# Altium schematic sheet 01-POWER.SchDoc
size A4
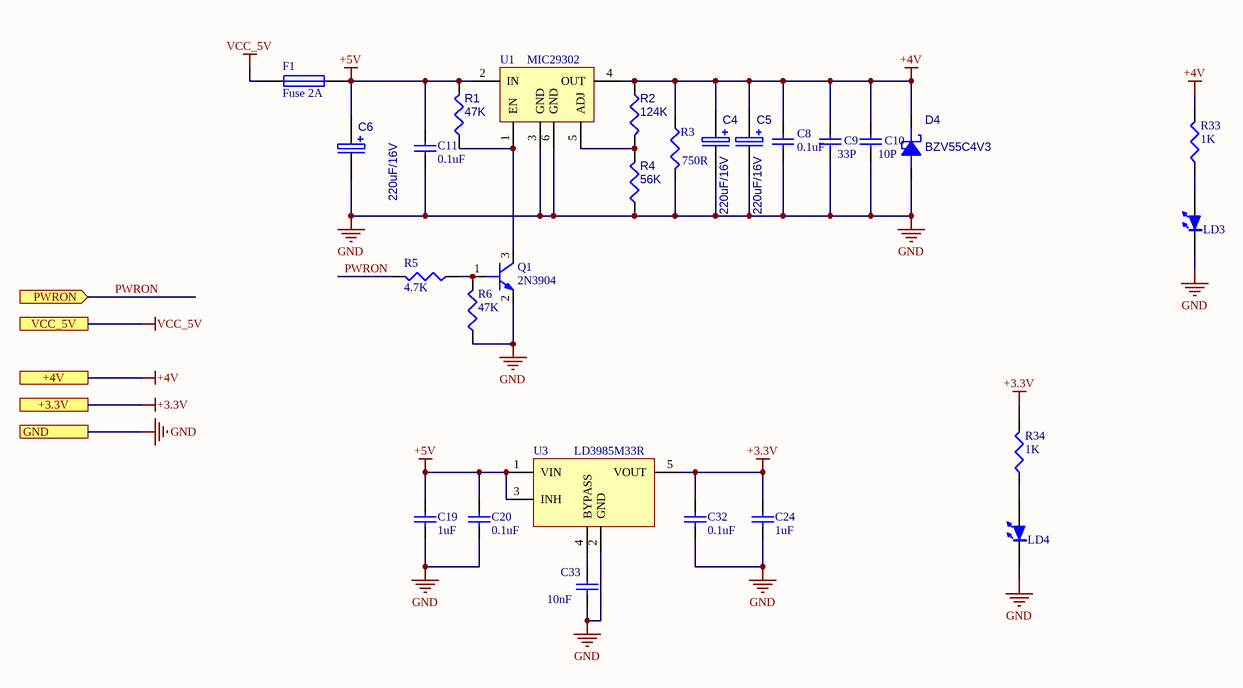
[diagram p0: 01-POWER.SchDoc]

## Parts
C4  220uF/16V  [C_TAN_D]
C5  220uF/16V  [C_TAN_D]
C6  220uF/16V  [C_TAN_D]
C8  0.1uF  [0603_C]
C9  33P  [0603_C]
C10  10P  [0603_C]
C11  0.1uF  [0603_C]
C19  1uF  [0603_C]
C20  0.1uF  [0603_C]
C24  1uF  [0603_C]
C32  0.1uF  [0603_C]
C33  10nF  [0603_C]
D4  BZV55C4V3  [SOD-80]
F1  Fuse 2A  [1812_F]
LD3  WHITE  [LED_0603]  (value not drawn)
LD4  WHITE  [LED_0603]  (value not drawn)
Q1  2N3904  [SOT23]
R1  47K  [0603_R]
R2  124K  [0603_R]
R3  750R  [0603_R]
R4  56K  [0603_R]
R5  4.7K  [0603_R]
R6  47K  [0603_R]
R33  1K  [0603_R]
R34  1K  [0603_R]
U1  MIC29302  [TO-263-5]
U3  LD3985M33R  [SOT23-5L]

## Ports
+3.3V, +4V, GND, PWRON, VCC_5V

## Nets
+3.3V: C24.1 C32.1 R34.1 U3.5(VOUT) ; port +3.3V
+4V: C4.1(+) C5.1(+) C8.2 C9.2 C10.2 D4.2(CATHODE) R2.2 R3.2 R33.1 U1.4(OUT) ; port +4V
+5V: C6.1(+) C11.2 C19.1 C20.1 F1.2 R1.1 U1.2(IN) U3.1(VIN) U3.3(INH)
GND: C4.2(-) C5.2(-) C6.2(-) C8.1 C9.1 C10.1 C11.1 C19.2 C20.2 C24.2 C32.2 C33.2 D4.1(ANODE) LD3.K LD4.K Q1.2(EMITTER) R3.1 R4.2 R6.2 U1.3(GND) U1.6(GND) U3.2(GND) ; port GND
VCC_5V: F1.1 ; port VCC_5V
PWRON: R5.1 ; port PWRON
NetC33_1: C33.1 U3.4(BYPASS)
NetLD3_A: LD3.A R33.2
NetLD4_A: LD4.A R34.2
NetQ1_1: Q1.1(BASE) R5.2 R6.1
NetQ1_3: Q1.3(COLLECTOR) R1.2 U1.1(EN)
NetR2_1: R2.1 R4.1 U1.5(ADJ)

## Library data of the parts
C4-C6 = ECAP: E-CAP
C8-C11 = Cap Semi: Capacitor; Published: 8-Jun-2000; LatestRevisionDate: 29-May-2009; LatestRevisionNote: IPC-7351 Footprint Added.; PackageReference: C1206; Publisher: Altium Limited; PackageDescription: Chip Capacitor
C19 C20 C24 C32 C33 = Cap Semi_1: Capacitor; Published: 8-Jun-2000; LatestRevisionDate: 29-May-2009; LatestRevisionNote: IPC-7351 Footprint Added.; PackageReference: C1206; Publisher: Altium Limited; PackageDescription: Chip Capacitor
D4 = DIODE SCHOTTKY
F1 = Fuse 1: Fuse; Published: 8-Jun-2000; LatestRevisionDate: 17-Jul-2002; LatestRevisionNote: Re-released for DXP Platform.; PackageReference: PIN-W2/E2.8; Publisher: Altium Limited; PackageDescription: Thru-Hole; 2 Leads
LD3 LD4 = LED
Q1 = NPN
R1 R2 R4 = R0.25W: RESISTOR
R3 R5 R6 R33 R34 = RES1
U3 = LD3985MSSR